# Altium schematic sheet LCL_pin_bias.SchDoc
size A4; Organization: Altium Limited; Address1: L3, 12a Rodborough Rd; Address2: Frenchs Forest; Address3: NSW; Address4: Australia 2086; DocumentNumber: 7; SheetNumber: 7; SheetTotal: 19
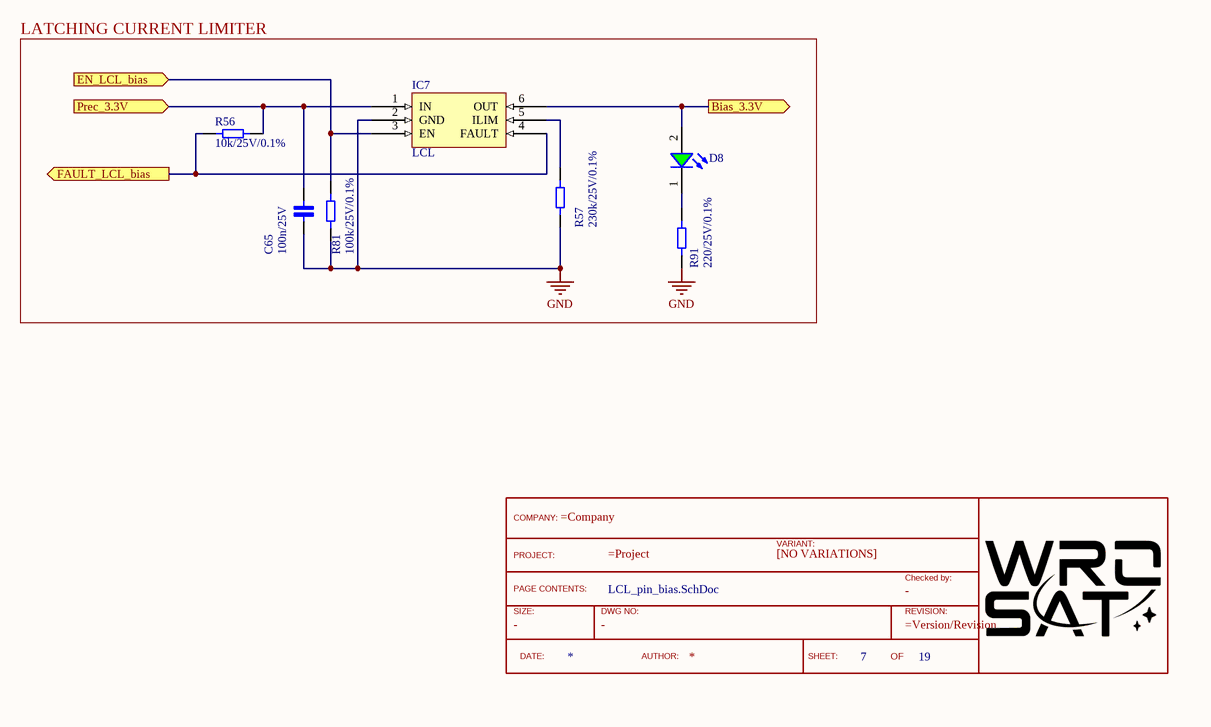
[diagram p0: LCL_pin_bias.SchDoc]

## Parts
?  TitleBlock  (value not drawn)  (graphical)
C65  100n/25V  [Cap_0402]
D8  Green, 3.2V  [WL-SMCW_0603_H=0.7mm]  (value not drawn)
IC7  LCL  [SOT-23-6]
R56  10k/25V/0.1%  [RES_0402]
R57  230k/25V/0.1%  [RES_0402]
R81  100k/25V/0.1%  [RES_0402]
R91  220/25V/0.1%  [RES_0402]

## Blocks framed on the sheet
LATCHING CURRENT LIMITER: C65 D8 IC7 R56 R57 R81 R91

## Ports
Bias_3.3V (out), EN_LCL_bias (in), FAULT_LCL_bias (out), Prec_3.3V (in)

## Nets
GND: C65.1 IC7.2(GND) R57.1 R81.1 R91.1
Bias_3.3V: D8.2(A) IC7.6(OUT) ; port Bias_3.3V
EN_LCL_bias: IC7.3(EN) R81.2 ; port EN_LCL_bias
FAULT_LCL_bias: IC7.4(FAULT) R56.1 ; port FAULT_LCL_bias
Prec_3.3V: C65.2 IC7.1(IN) R56.2 ; port Prec_3.3V
NetD8_1: D8.1(K) R91.2
NetIC7_5: IC7.5(ILIM) R57.2

## Notes on the sheet
- Title
- Size:
- Date:
- A3
- Number:
- Time:
- Revision:
- Sheet
- of
- File:
- (in symbol TitleBlock) COMPANY:; VARIANT:; PROJECT:; [NO VARIATIONS]; Checked by:; PAGE CONTENTS:; SIZE:; DWG NO:; REVISION:; DATE:; AUTHOR:; SHEET:; OF

## Library data of the parts
? = TitleBlock: Standard TitleBlock; DrawingNo: -; Size: -; Checked: -
C65 = Cap_0402_100n: Ceramic Capacitor 100n / 0402 / 25V / ±5%, Wurth Elektronik MLCC; ComponentLink1Description: New link; ComponentLink1URL: https://www.we-online.com/catalog/en/WCAP-CSGP-25VDC
D8 = 150060GS75000: WL-SMCW SMT Mono-color Chip LED Waterclear, size 0603, Green, 3.2V, 140deg; Chip Technology: InGaN; Dominant Wavelength typ.: 525nm; Luminous Intensity typ.: 430mcd; Peak Wavelength typ.: 515nm; Viewing Angle: 140deg; ComponentLink1Description: Manufacturer; ComponentLink1URL: http://www.we-online.de; ComponentLink2URL: https://www.we-online.com/catalog/datasheet/150060GS75000.pdf; ComponentLink2Description: Datasheet; Forward Voltage typ.: 3.2V; Emitting Color: Green; Mounting Technology: SMT; Operating Temperature: -40 to +85degC; Published Date: December 2019; Part Number: 150060GS75000; Packaging: Tape and Reel; Size: 0603; Publisher: Wurth Elektronik
IC7 = TPS2553: Latch-off Current Limiter; ComponentLink1Description: New link; ComponentLink1URL: https://www.ti.com/lit/ds/symlink/tps2553.pdf?ts=1603819295065&ref_url=https%253A%252F%252Fwww.google.com%252F
R56 = Res_0402_10k: Vishay, thin film resistor 10k/25V/0.1%
R57 = Res_0402_230k: Vishay, thin film resistor 230k/25V/0.1%
R81 = Res_0402_100k: Vishay, thin film resistor 100k/25V/0.1%
R91 = Res_0402_1: Vishay, thin film resistor 1/25V/0.1%